# Altium schematic sheet LPCB225 - POWER DOWN CONTROLLER.SchDoc
size A3; Address1: Factory 10; Address2: 9-13 Dingley Avenue, Dandeong, VICTORIA 3175, AUSTRALIA; DocumentNumber: 5; Revision: 1; SheetNumber: 5; SheetTotal: 6; Lockie__PCB_SUB_ASSEMBLY: Power Down Controller; Lockie__PCB_ASSEMBLY: Module; Lockie__LDL: LPCB225; Lockie__PCB_DESCRIPTION: BMS Module
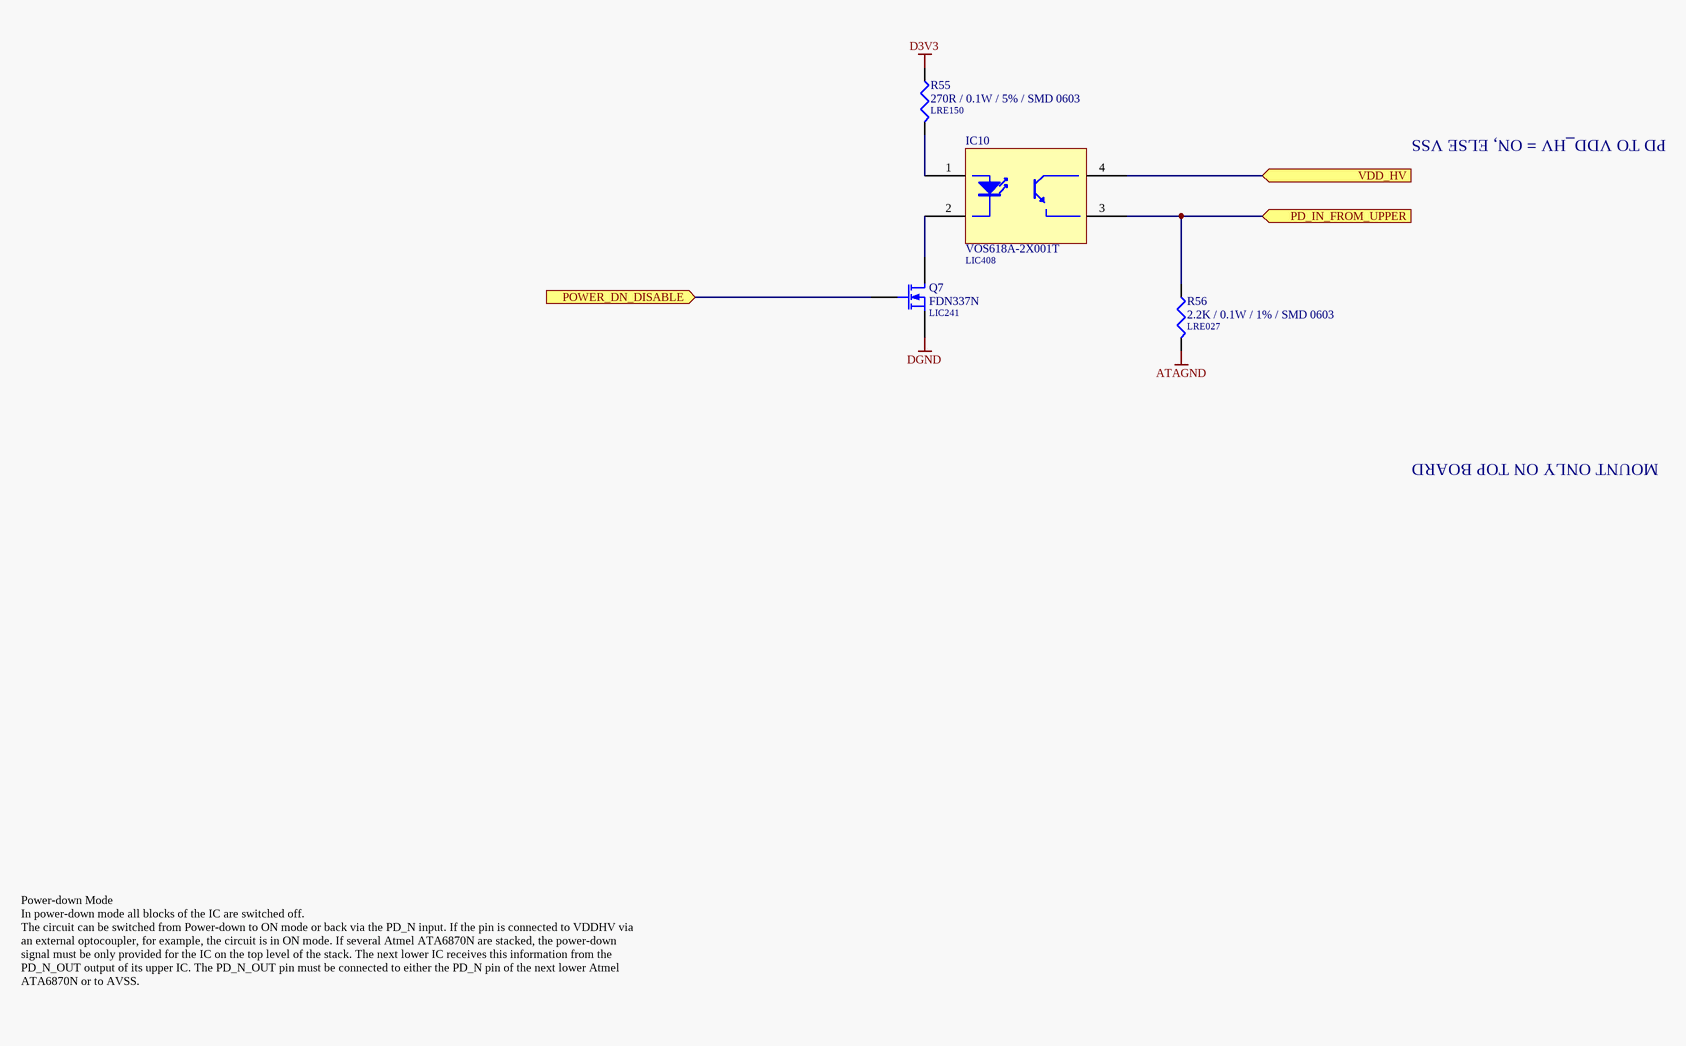
[diagram p0: LPCB225 - POWER DOWN CONTROLLER.SchDoc]

## Parts
IC10  VOS618A-2X001T  LDL_NUMBER: LIC408  [LFP085__VOS618A]
Q7  FDN337N  LDL_NUMBER: LIC241  [LFP021__SOT23]
R55  270R / 0.1W / 5% / SMD 0603  LDL_NUMBER: LRE150  [LFP020__CR1608-0603-IPC7351_B]
R56  2.2K / 0.1W / 1% / SMD 0603  LDL_NUMBER: LRE027  [LFP020__CR1608-0603-IPC7351_B]

## Ports
PD_IN_FROM_UPPER (in), POWER_DN_DISABLE (in), VDD_HV (in)

## Nets
ATAGND: R56.1
D3V3: R55.2
DGND: Q7.2(S)
PD_IN_FROM_UPPER: IC10.3 R56.2 ; port PD_IN_FROM_UPPER
POWER_DN_DISABLE: Q7.1(G) ; port POWER_DN_DISABLE
VDD_HV: IC10.4 ; port VDD_HV
NetIC10_1: IC10.1(A) R55.1
NetIC10_2: IC10.2(K) Q7.3(D)

## Notes on the sheet
- PD TO VDD_HV = ON, ELSE VSS
- MOUNT ONLY ON TOP BOARD
- Power-down Mode
  In power-down mode all blocks of the IC are switched off.
  The circuit can be switched from Power-down to ON mode or back via the PD_N input. If the pin is connected to VDDHV via
  an external optocoupler, for example, the circuit is in ON mode. If several Atmel ATA6870N are stacked, the power-down
  signal must be only provided for the IC on the top level of the stack. The next lower IC receives this information from the
  PD_N_OUT output of its upper IC. The PD_N_OUT pin must be connected to either the PD_N pin of the next lower Atmel
  ATA6870N or to AVSS.
- PCB COMPONENT DESCRIPTION
- LDL NUMBER
- Assembly Details
- Size
- Drawing File Name
- Revision
- http://rloop.org
- Scale
- A3
- Sheet Details
- N.T.S
- Sheet:
- Of:

## Library data of the parts
IC10 = VOS618A-2X001T: IC, Optocoupler, SMD [LIC408]; FMEDA__OPERATING__TEMP_MAX: 50; FMEDA__OPERATING__TEMP_MIN: -20; FMEDA__OPERATING__TEMP_TYP: 27; FMEDA__CHANNEL: COM
Q7 = FDN337N: FET, N Channel, Logic Level, SMD SOT23 [LIC241]; FMEDA__OPERATING__POWER_MAX: 0; FMEDA__OPERATING__TEMP_MAX: 50; FMEDA__OPERATING__TEMP_TYP: 27; FMEDA__OPERATING__VOLTAGE_MAX: 3.3; FMEDA__OPERATING__TEMP_MIN: -20; FMEDA__CHANNEL: COM; FMEDA__OPERATING__POWER_MIN: 0; FMEDA__OPERATING__POWER_TYP: 0; FMEDA__OPERATING__VOLTAGE_MIN: 0; FMEDA__OPERATING__VOLTAGE_TYP: 3.3; FMEDA__FUNCTION_IN_SYSTEM: *
R55 = 270R / 0.1W / 5% / SMD 0603: Resistor, Ceramic Chip, 270R, 0.1W, 1%, SMD 0603 [LRE150]; Value: 820; FMEDA__OPERATING__POWER_MAX: 0; FMEDA__OPERATING__TEMP_MAX: 50; FMEDA__OPERATING__TEMP_MIN: -20; FMEDA__OPERATING__TEMP_TYP: 27; FMEDA__CHANNEL: COM; FMEDA__OPERATING__POWER_MIN: 0; FMEDA__OPERATING__VOLTAGE_MAX: 0; FMEDA__OPERATING__VOLTAGE_MIN: 0; FMEDA__OPERATING__VOLTAGE_TYP: 0; FMEDA__FUNCTION_IN_SYSTEM: *
R56 = 2.2K / 0.1W / 1% / SMD 0603: Resistor, Ceramic Chip, 2.2K, 0.1W, 1%, SMD 0603 [LRE027]; FMEDA__OPERATING__VOLTAGE_MIN: 0; FMEDA__OPERATING__TEMP_MIN: -20; FMEDA__OPERATING__TEMP_TYP: 27; FMEDA__OPERATING__TEMP_MAX: 50; FMEDA__CHANNEL: COM; VALUE: 2.2K; FMEDA__OPERATING__VOLTAGE_MAX: 0; FMEDA__OPERATING__POWER_MIN: 0; FMEDA__OPERATING__POWER_MAX: 0; FMEDA__FUNCTION_IN_SYSTEM: *; FMEDA__OPERATING__VOLTAGE_TYP: 0